# Altium schematic sheet EEPROM.SchDoc
size 420 x 297 mm; SheetNumber: 12; SheetTotal: 23
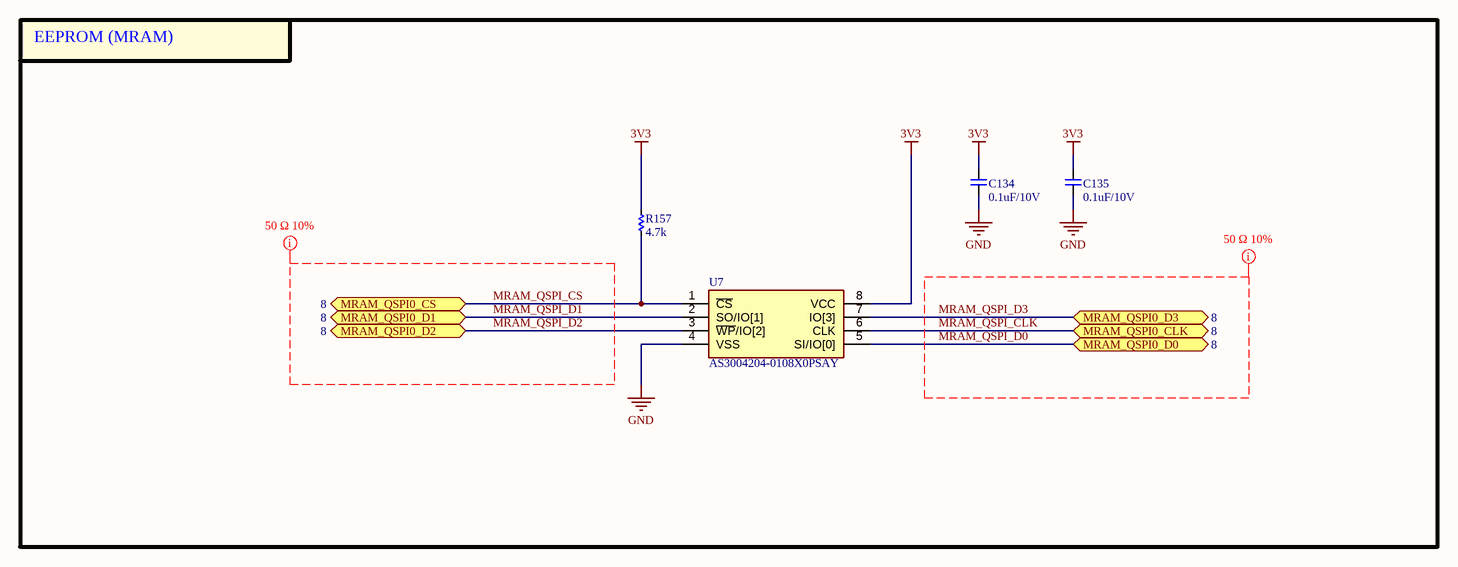
[diagram p0: EEPROM.SchDoc]

## Parts
C134  0.1uF/10V  [CAP_C_1005X50_L]
C135  0.1uF/10V  [CAP_C_1005X50_L]
R157  4.7k  [RES_C_1005x30_L]
U7  AS3004204-0108X0PSAY  [SOIC127P790X216-8N]

## Blocks framed on the sheet
EEPROM (MRAM): C134 C135 R157 U7

## Ports
MRAM_QSPI0_CLK (bidir, see 8), MRAM_QSPI0_CS (bidir, see 8), MRAM_QSPI0_D0 (bidir, see 8), MRAM_QSPI0_D1 (bidir, see 8), MRAM_QSPI0_D2 (bidir, see 8), MRAM_QSPI0_D3 (bidir, see 8)

## Nets
3V3: C134.2 C135.2 R157.1 U7.8(VCC)
GND: C134.1 C135.1 U7.4(VSS)
MRAM_QSPI_CLK: U7.6(CLK) ; port MRAM_QSPI0_CLK
MRAM_QSPI_CS: R157.2 U7.1(~{CS}) ; port MRAM_QSPI0_CS
MRAM_QSPI_D0: U7.5(SI/IO[0]) ; port MRAM_QSPI0_D0
MRAM_QSPI_D1: U7.2(SO/IO[1]) ; port MRAM_QSPI0_D1
MRAM_QSPI_D2: U7.3(~{WP}/IO[2]) ; port MRAM_QSPI0_D2
MRAM_QSPI_D3: U7.7(IO[3]) ; port MRAM_QSPI0_D3

## Layout directives
net class QSPI: MRAM_QSPI_CLK, MRAM_QSPI_CS, MRAM_QSPI_D0, MRAM_QSPI_D1, MRAM_QSPI_D2, MRAM_QSPI_D3

## Notes on the sheet
- Project:
- BEE-1012
- Sub-system:
- SATELLITE_EXP_CONTROLLER
- Design by:
- SANG HUYNH
- BAO BUI
- Sheet title:
- Sheet
- A3
- of
- Checked by:
- Approved by:
- VU PHAM
- Revision:
- Document No:
- Size:
- Date:

## Library data of the parts
C134 C135 = _CAP_C_2: CAP CHIP
R157 = _RES_B_2: RES
U7 = AS3004204-0108X0PSAY: MRAM Avalanche High Performance Serial P-SRAM 4Mb in SOIC8 package with QSPI - 108MHz interface, 3V, -40 C to 105 C; Manufacturer_Name: Avalanche Technology; Geometry.Height: 2.16mm; Manufacturer_Part_Number: AS3004204-0108X0PSAY; Mouser Part Number: 793-30042040108X0PSY; Mouser Price/Stock: https://www.mouser.co.uk/ProductDetail/Avalanche-Technology/AS3004204-0108X0PSAY/?qs=eP2BKZSCXI7G0ggegRejGg%3D%3D; Arrow Part Number: *; Arrow Price/Stock: *; Datasheet Link: https://www.mouser.ph/ProductDetail/Avalanche-Technology/AS3004204-0108X0PSAY?qs=eP2BKZSCXI7G0ggegRejGg%3D%3D